# EAGLE design untitled_front (EAGLE 8.2.1)
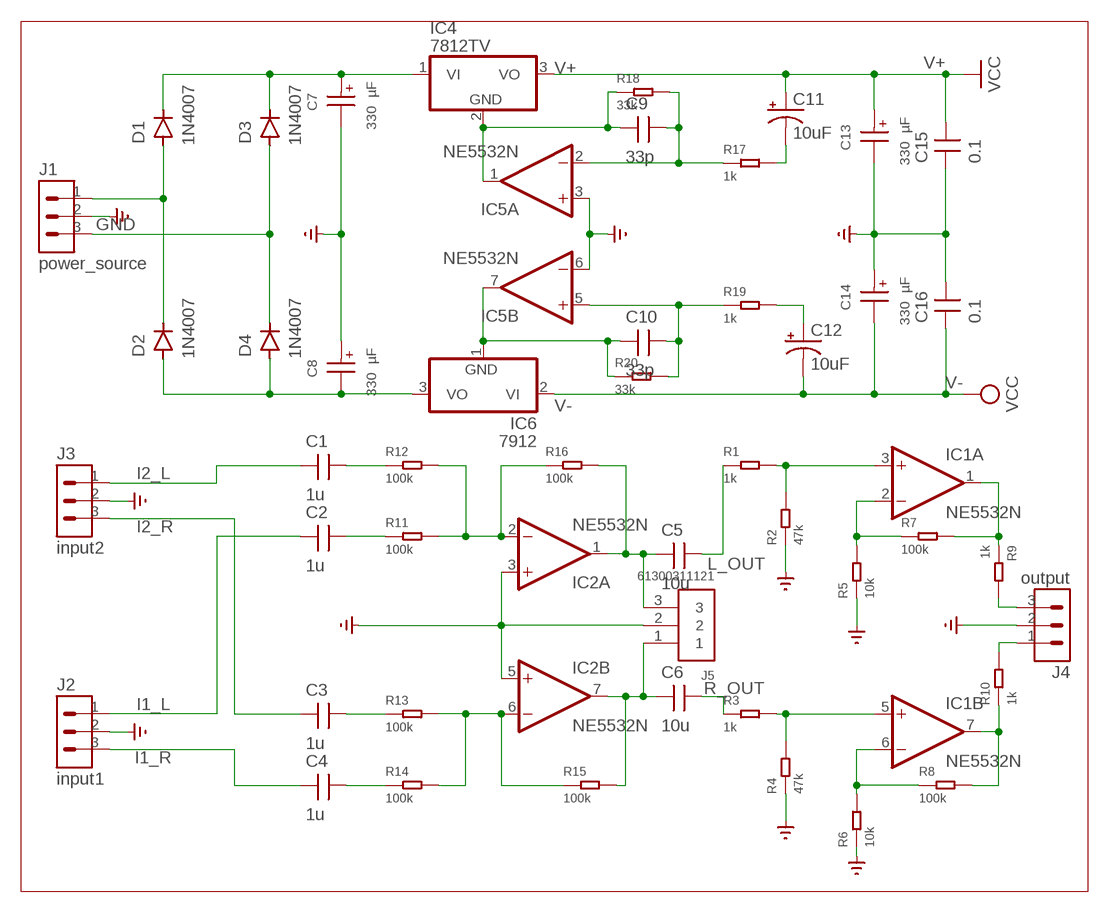
[diagram p0: schematic, sheet 1]

## Parts
C1  1u  5.08MM-  [5.08MM-独石电容]
C2  1u  5.08MM-  [5.08MM-独石电容]
C3  1u  5.08MM-  [5.08MM-独石电容]
C4  1u  5.08MM-  [5.08MM-独石电容]
C5  10u  5.08MM-  [5.08MM-独石电容]
C6  10u  5.08MM-  [5.08MM-独石电容]
C7  330 µF  WCAP-AT1H_18X35.5_860241081001  [WCAP-AT1H_18X35.5(DXL)]
C8  330 µF  WCAP-AT1H_18X35.5_860241081001  [WCAP-AT1H_18X35.5(DXL)]
C9  33p  5.08MM-  [5.08MM-独石电容]
C10  33p  5.08MM-  [5.08MM-独石电容]
C11  10uF  10UF-POLAR-RADIAL-2.5MM-25V-20%  [CPOL-RADIAL-2.5MM-5MM]
C12  10uF  10UF-POLAR-RADIAL-2.5MM-25V-20%  [CPOL-RADIAL-2.5MM-5MM]
C13  330 µF  WCAP-AT1H_18X35.5_860241081001  [WCAP-AT1H_18X35.5(DXL)]
C14  330 µF  WCAP-AT1H_18X35.5_860241081001  [WCAP-AT1H_18X35.5(DXL)]
C15  0.1  5.08MM-  [5.08MM-独石电容]
C16  0.1  5.08MM-  [5.08MM-独石电容]
D1  1N4007  [DO-41]
D2  1N4007  [DO-41]
D3  1N4007  [DO-41]
D4  1N4007  [DO-41]
IC1  NE5532N  [DIL08]
IC2  NE5532N  [DIL08]
IC4  7812TV  [TO220V]
IC5  NE5532N  [DIL08]
IC6  7912  7912T  [TO220H]
J1  power_source  B3P-VH(LF)(SN)  [HDR-03]
J2  input1  B3P-VH(LF)(SN)  [HDR-03]
J3  input2  B3P-VH(LF)(SN)  [HDR-03]
J4  output  B3P-VH(LF)(SN)  [HDR-03]
J5  61300311121  [61300311121]
R1  1k  DIP-RES-1M-5%-1/4W(PR-D2.3XL6.5MM)  [PR-D2.3XL6.5MM]
R2  47k  DIP-RES-1M-5%-1/4W(PR-D2.3XL6.5MM)  [PR-D2.3XL6.5MM]
R3  1k  DIP-RES-1M-5%-1/4W(PR-D2.3XL6.5MM)  [PR-D2.3XL6.5MM]
R4  47k  DIP-RES-1M-5%-1/4W(PR-D2.3XL6.5MM)  [PR-D2.3XL6.5MM]
R5  10k  DIP-RES-1M-5%-1/4W(PR-D2.3XL6.5MM)  [PR-D2.3XL6.5MM]
R6  10k  DIP-RES-1M-5%-1/4W(PR-D2.3XL6.5MM)  [PR-D2.3XL6.5MM]
R7  100k  DIP-RES-1M-5%-1/4W(PR-D2.3XL6.5MM)  [PR-D2.3XL6.5MM]
R8  100k  DIP-RES-1M-5%-1/4W(PR-D2.3XL6.5MM)  [PR-D2.3XL6.5MM]
R9  1k  DIP-RES-1M-5%-1/4W(PR-D2.3XL6.5MM)  [PR-D2.3XL6.5MM]
R10  1k  DIP-RES-1M-5%-1/4W(PR-D2.3XL6.5MM)  [PR-D2.3XL6.5MM]
R11  100k  DIP-RES-1M-5%-1/4W(PR-D2.3XL6.5MM)  [PR-D2.3XL6.5MM]
R12  100k  DIP-RES-1M-5%-1/4W(PR-D2.3XL6.5MM)  [PR-D2.3XL6.5MM]
R13  100k  DIP-RES-1M-5%-1/4W(PR-D2.3XL6.5MM)  [PR-D2.3XL6.5MM]
R14  100k  DIP-RES-1M-5%-1/4W(PR-D2.3XL6.5MM)  [PR-D2.3XL6.5MM]
R15  100k  DIP-RES-1M-5%-1/4W(PR-D2.3XL6.5MM)  [PR-D2.3XL6.5MM]
R16  100k  DIP-RES-1M-5%-1/4W(PR-D2.3XL6.5MM)  [PR-D2.3XL6.5MM]
R17  1k  DIP-RES-1M-5%-1/4W(PR-D2.3XL6.5MM)  [PR-D2.3XL6.5MM]
R18  33k  DIP-RES-1M-5%-1/4W(PR-D2.3XL6.5MM)  [PR-D2.3XL6.5MM]
R19  1k  DIP-RES-1M-5%-1/4W(PR-D2.3XL6.5MM)  [PR-D2.3XL6.5MM]
R20  33k  DIP-RES-1M-5%-1/4W(PR-D2.3XL6.5MM)  [PR-D2.3XL6.5MM]

## Nets
GND: C7.2(-) C8.1(+) C13.2(-) C14.1(+) C15.P$2 C16.P$1 IC2.3(A:+IN) IC2.5(B:+IN) IC5.3(A:+IN) IC5.6(B:-IN) J1.2 J2.2 J3.2 J4.2 J5.2 R2.1 R4.1 R5.1 R6.1 ; supply symbol labelled SUPPLY_BRASTAN_GND_
I1_L: C2.P$2 J2.1
I1_R: C4.P$2 J2.3
I2_L: C1.P$2 J3.1
I2_R: C3.P$2 J3.3
L_OUT: C5.P$1 R1.1
N$1: IC1.6(B:-IN) R6.2 R8.1
N$2: IC1.2(A:-IN) R5.2 R7.1
N$3: IC1.3(A:+IN) R1.2 R2.2
N$4: IC1.5(B:+IN) R3.2 R4.2
N$5: IC1.7(B:OUT) R8.2 R10.1
N$6: IC1.1(A:OUT) R7.2 R9.1
N$7: J4.1 R10.2
N$8: J4.3 R9.2
N$9: D1.A D2.C J1.1
N$10: C3.P$1 R13.1
N$11: C1.P$1 R12.1
N$12: C2.P$1 R11.1
N$13: C4.P$1 R14.1
N$14: IC2.6(B:-IN) R13.2 R14.2 R15.1
N$15: IC2.2(A:-IN) R11.2 R12.2 R16.1
N$16: C6.P$2 IC2.7(B:OUT) J5.1 R15.2
N$17: C5.P$2 IC2.1(A:OUT) J5.3 R16.2
N$18: D3.A D4.C J1.3
N$19: C8.2(-) D2.A D4.A IC6.3(VO)
N$20: C7.1(+) D1.C D3.C IC4.1(VI)
N$22: C9.P$2 IC4.2(GND) IC5.1(A:OUT) R18.1
N$23: C10.P$1 IC5.5(B:+IN) R19.1 R20.2
N$24: C9.P$1 IC5.2(A:-IN) R17.1 R18.2
N$25: C10.P$2 IC5.7(B:OUT) IC6.1(GND) R20.1
N$27: C12.1(+) R19.2
N$28: C11.2(-) R17.2
R_OUT: C6.P$1 R3.1
V+: C11.1(+) C13.1(+) C15.P$1 IC4.3(VO) ; supply symbol labelled VCC
V-: C12.2(-) C14.2(-) C16.P$2 IC6.2(VI) ; supply symbol labelled VCC

## Power pins joined to a net without a drawn wire
V+: IC1.8(P:V+) IC2.8(P:V+) IC5.8(P:V+)
V-: IC1.4(P:V-) IC2.4(P:V-) IC5.4(P:V-)

## Library data of the parts
C1-C6 C9 C10 C15 C16 = Audio-Power-amlifier:5.08MM-; LONG: 5.08mm
C7 C8 C13 C14 = Wurth_Capacitors_WCAP-AT1H:WCAP-AT1H_18X35.5: WCAP-AT1H Aluminium Electrolytic Capacitors Long Life +105 °C Characteristics Long life product series Mounting style: THT Radial Capacitance range: 6.8 µF ‒ 3300 µF Capacitance tolerance: ±20 % Voltage range (UR): 10 ‒ 450 V(DC) Operating temperature: -40 °C up to +105 °C for UR ≤100 V(DC) -25 °C up to +105 °C for UR > 100 V(DC) Endurance: 5000 ‒ 10000 h @ +105 °C Dimensions (DxL) in mm: 5.0 x 11.0 up to 18.0 x 35.5 Recommended soldering: Wave soldering Applications Long life applications (industry, medical) Filtering Smoothing Energy storage Coupling e.g. Switched-mode power supply, AC/DC converter, adapter, charger, digital camera <https://www.we-online.com/catalog/media/o14727v209%20Family_WCAP-AT1H.jpg> Details see: https://www.we-online.com/catalog/en/WCAP-AT1H/ Updated by yingchun,Shan;2020-02-28 2020(C) Würth Elektronik; DATASHEET-URL: https://www.we-online.com/catalog/datasheet/860241081001.pdf; DF: 15%; DIAMETER: 18mm; I-LEAK: 2740uA; I-RIPPLE: 3220mA; L: 35.5mm; OPERATING-TEMPERATURE: -25 °C up to +105 °C; PART-NUMBER: 860241081001; PITCH: 7.5mm; TECHNICAL-REFERENCE: ATJL355331M200DSPAEK000; VR: 200V(DC)
C11 C12 = SparkFun-Capacitors:10UF-POLAR: 10.0µF polarized capacitors A capacitor is a passive two-terminal electrical component used to store electrical energy temporarily in an electric field.; PROD_ID: CAP-08440
D1-D4 = Diodes:1N4007: DIODE GEN PURP 1KV 1A DO41 Manufacturer's datasheet <https://www.mccsemi.com/pdf/Products/1N4001-1N4007(DO-41).pdf>; CREATED_BY: PCBLayout.com; DIGIKEY_PART_NUMBER: 1N4007MSCT-ND; MANUFACTURER: Micro Commercial Co; MPN: 1N4007; PACKAGE: DO-41
IC1 IC2 IC5 = linear:NE5532: AUDIO AMPLIFIER
IC4 = linear:78*: Positive VOLTAGE REGULATOR Source: http://cache.national.com/ds/LM/LM78L05.pdf http://www.fairchildsemi.com/ds/LM/LM7805.pdf
IC6 = linear:79*: Negative VOLTAGE REGULATOR
J1-J4 = Connectors:B3P-VH(LF)(SN): CONN HEADER VERT 3POS 3.96MM Manufacturer's datasheet <http://www.jst-mfg.com/product/pdf/eng/eVH.pdf>; CREATED_BY: PCBLayout.com; DIGIKEY_PART_NUMBER: 455-1640-ND; MANUFACTURER: JST Sales America Inc.; MPN: B3P-VH(LF)(SN)
J5 = Headers:61300311121: CONN HEADER VERT 3POS 2.54MM Manufacturer's datasheet <https://katalog.we-online.de/em/datasheet/6130xx11121.pdf>; CREATED_BY: PCBLayout.com; DIGI_KEY_PART_NUMBER: 732-5316-ND; MANUFACTURER: Wurth Electronics Inc.; MPN: 61300311121
R1-R20 = OPL_Resistor:DIP-RES-1M-5%-1/4W(PR-D2.3XL6.5MM): 301020005; MPN: FHCFR-1/4W-105J; VALUE: 1M

## Board
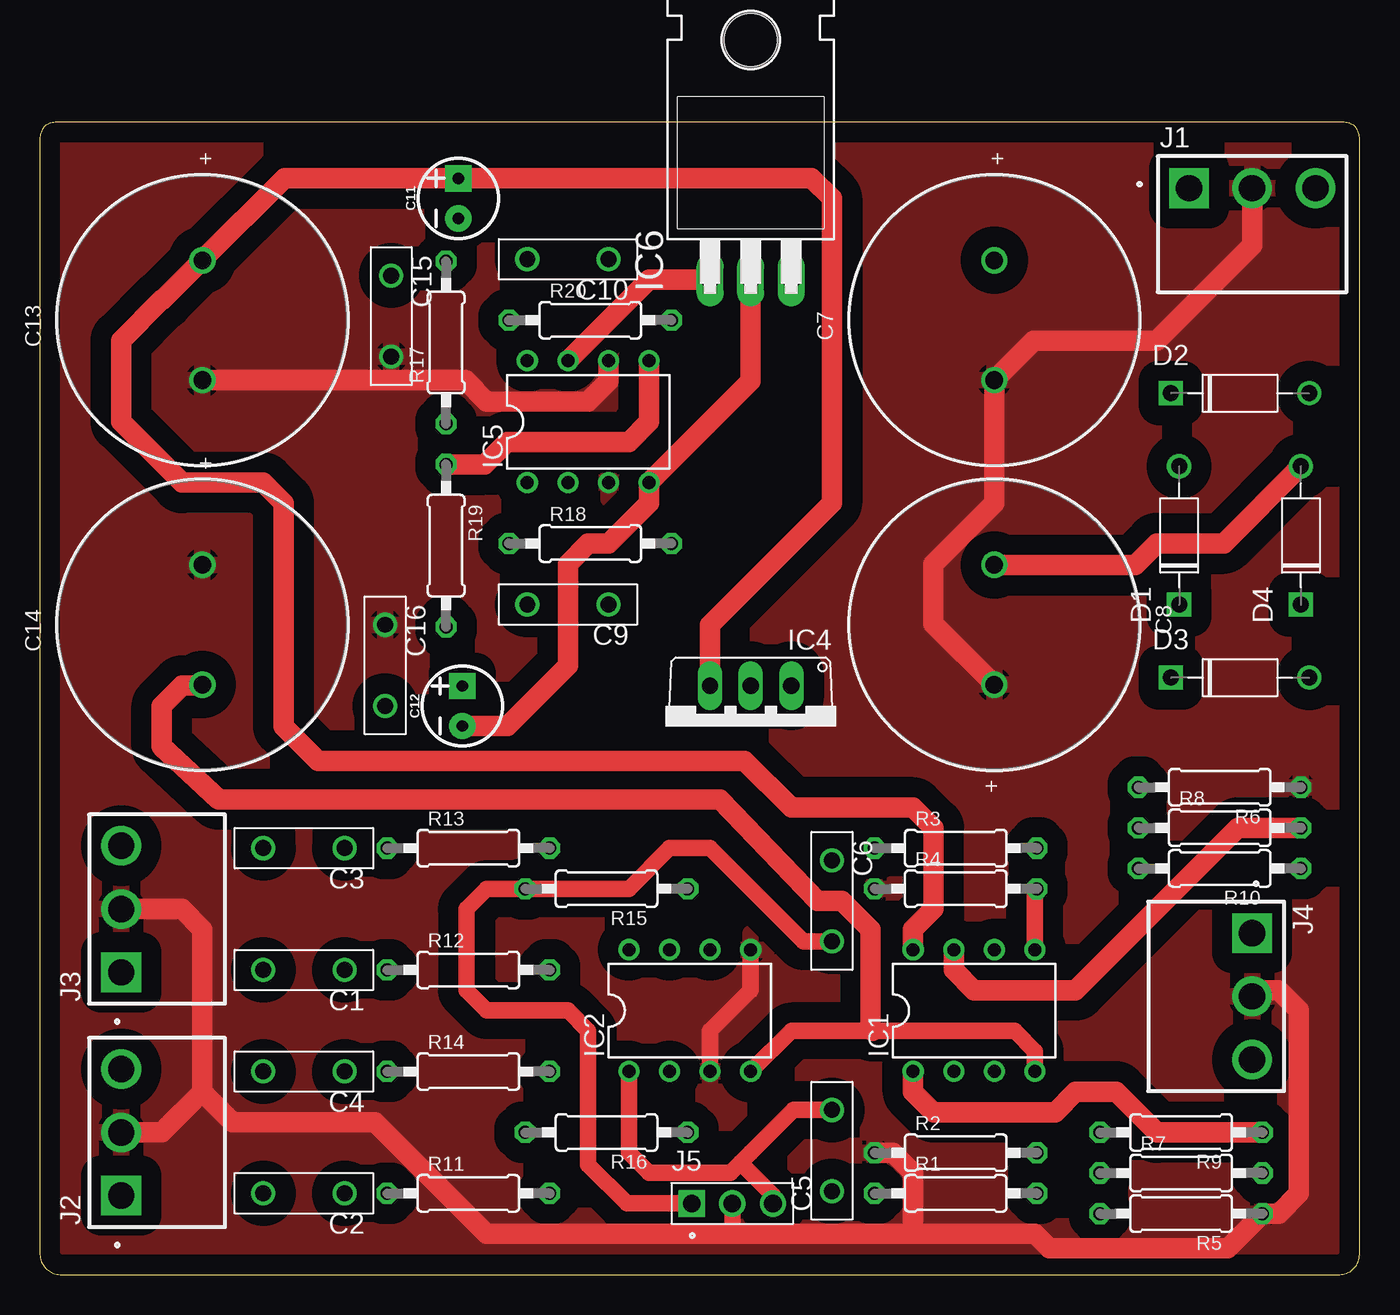
[diagram p1: board, top side]
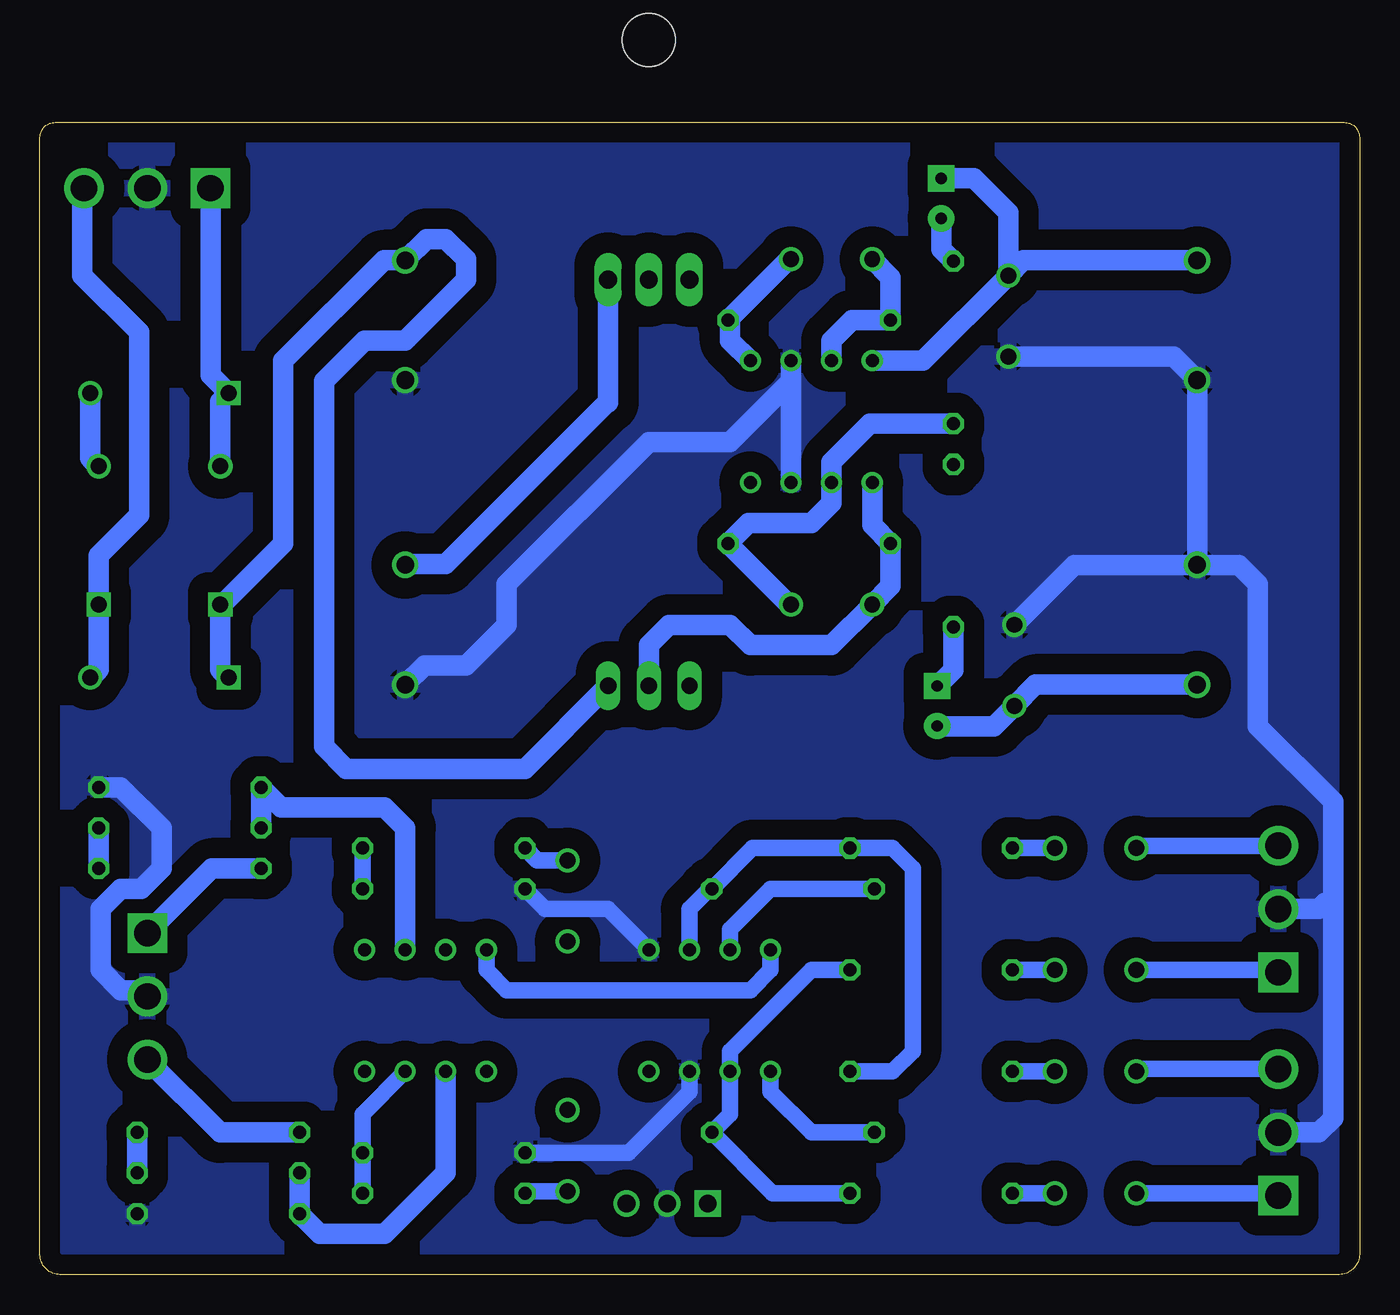
[diagram p2: board, bottom side, seen from below]

Size 82.53 x 72.06 mm. Coordinates in mm from the lower left corner, seen from the top.
Outline: 0,71.12 0,1.27 arc90 1.27,0 81.28,0 arc90 82.53,1.25 82.53,71.12 arc90 81.59,72.06 0.94,72.06 arc90 0,71.12
Copper layers (1*16): Top 0.035mm / dielectric 1.5mm / Bottom 0.035mm
Design rules "default": minimum track width 6mil, minimum drill 0.35mm, track to track 6mil, track to pad 6mil, pad to pad 6mil, via to via 6mil, smd to smd 6mil, copper to edge 40mil, drill to drill 6mil, minimum pad ring 10mil, minimum via ring 8mil, stop-mask expansion 4mil, vias tented up to drill 0mil, thermal gap 10mil

### Footprints (pad centres in the part's own frame; a part is rotated, then mirrored left to right if it is on the bottom)
5.08MM-独石电容 = drill 1: P$1 -2.54,0; P$2 2.54,0
WCAP-AT1H_18X35.5(DXL) = drill 1.1: 1 3.75,0; 2 -3.75,0
CPOL-RADIAL-2.5MM-5MM = drill 0.7 pad 1.651 square: 1 1.25,0 | drill 0.7 pad 1.651: 2 -1.25,0
DO-41 = drill 1: A 4.325,0 | drill 1 square: C -4.325,0
DIL08 = drill 0.813 pad 1.27: 1 -3.81,-3.81; 2 -1.27,-3.81; 3 1.27,-3.81; 4 3.81,-3.81; 5 3.81,3.81; 6 1.27,3.81; 7 -1.27,3.81; 8 -3.81,3.81
TO220V = drill 1.016 long: 1 -2.54,-2.54; 2 0,-2.54; 3 2.54,-2.54
TO220H = drill 1.118 long: 1 -2.54,-10.16; 2 0,-10.16; 3 2.54,-10.16 | hole 3.302: 0,4.826
HDR-03 = drill 1.65 square: 1 -3.96,0 | drill 1.65: 2 0,0; 3 3.96,0
61300311121 = drill 1.1 square: 1 -2.54,0 | drill 1.1: 2 0,0; 3 2.54,0
PR-D2.3XL6.5MM = drill 0.813 octagon: 1 -4.953,0; 2 5.207,0

### Placement (x,y rotation side)
C1  16.51,19.05 180 top
C2  16.51,5.08 180 top
C3  16.51,26.67 180 top
C4  16.51,12.7 180 top
C5  49.53,7.75 90 top
C6  49.53,23.37 270 top
C7  59.69,59.69 90 top
C8  59.69,40.64 270 top
C9  33.02,41.91 180 top
C10  33.02,63.5 180 top
C11  26.16,67.31 90 top
C12  26.42,35.56 90 top
C13  10.16,59.69 90 top
C14  10.16,40.64 90 top
C15  21.97,59.94 270 top
C16  21.59,38.1 270 top
D1  71.25,46.23 90 top
D2  75.06,55.12 0 top
D3  75.06,37.34 0 top
D4  78.87,46.23 90 top
IC1  58.42,16.51 0 top
IC2  40.64,16.51 0 top
IC4  44.45,34.29 180 top
IC5  34.29,53.34 0 top
IC6  44.45,72.39 0 top
J1  75.82,67.94 0 top
J2  5.08,8.89 90 top
J3  5.08,22.86 90 top
J4  75.82,17.4 270 top
J5  43.31,4.45 0 top
R1  57.15,5.08 0 top
R2  57.15,7.62 0 top
R3  57.15,26.67 0 top
R4  57.15,24.13 0 top
R5  71.5,3.81 180 top
R6  73.91,30.48 180 top
R7  71.25,6.35 0 top
R8  73.66,27.94 0 top
R9  71.5,8.89 180 top
R10  73.91,25.4 180 top
R11  26.67,5.08 0 top
R12  26.67,19.05 0 top
R13  26.67,26.67 0 top
R14  26.67,12.7 0 top
R15  35.56,24.13 180 top
R16  35.56,8.89 180 top
R17  25.4,58.17 90 top
R18  34.29,45.72 0 top
R19  25.4,45.72 270 top
R20  34.29,59.69 0 top

### Tracks (layer width: path | path; a pad name or v marks a point on that pad's centre or on a via)
GND
  Top 1.016: IC2.5 44.45,17.78 41.91,15.24 IC2.3 | J5.2 43.31,2.67 43.18,2.54
  Top 1.27: C13.2 26.61,55.94 27.94,54.61 34.29,54.61 35.56,55.88 IC5.6 | J2.2 7.62,8.89 10.16,11.43 | 10.16,11.43 10.16,21.59 8.89,22.86 J3.2 | 10.16,11.43 12.06,9.53 20.95,9.53 27.94,2.54 43.18,2.54 54.61,2.54 | C8.1 55.88,40.7 55.88,44.45 59.69,48.26 C7.2 62.17,58.42 69.85,58.42 75.82,64.39 J1.2 | 54.61,2.54 62.23,2.54 63.12,1.65 74.3,1.65 R5.1 77.47,3.81 78.74,5.08 78.74,16.51 77.47,17.78 76.2,17.78 J4.2 | R2.1 53.34,7.62 54.61,6.35 54.61,2.54
  Bottom 1.016: IC2.5 46.99,22.86 50.93,22.86 R4.1 | IC2.3 41.91,11.43 45.72,7.62 R2.1
  Bottom 1.27: C15.P$2 11.62,57.4 C13.2 C14.1 | C14.1 17.84,44.39 C16.P$1 | IC5.3 IC5.6 35.56,55.88 39.37,52.07 44.45,52.07 53.34,43.18 53.34,40.64 55.88,38.1 58.48,38.1 C8.1 | C14.1 7.56,44.39 6.35,43.18 6.35,34.29 1.65,29.59 1.65,23.24 | 1.65,23.24 2.16,23.24 2.54,22.86 J3.2 | 1.65,23.24 1.65,9.78 2.54,8.89 J2.2 | R6.1 77.47,30.48 74.93,27.94 74.93,25.4 76.2,24.13 77.47,24.13 78.74,22.86 78.74,19.05 77.47,17.78 76.2,17.78 J4.2
  pour Top (isolate 1.27): 1.27,72.39 0,71.12 0,1.27 1.27,0 81.28,0 82.55,1.27 82.55,71.12 81.28,72.39
  pour Bottom (isolate 1.27): 1.27,72.39 0,71.12 0,1.27 1.27,0 81.28,0 82.55,1.27 82.55,71.12 81.28,72.39
I1_L
  Bottom 1.016: C2.P$2 5.23,5.08 J2.1
I1_R
  Bottom 1.016: J2.3 13.82,12.85 C4.P$2
I2_L
  Bottom 1.016: C1.P$2 5.23,19.05 J3.1
I2_R
  Bottom 1.016: J3.3 13.82,26.82 C3.P$2
L_OUT
  Bottom 1.016: C5.P$1 52.07,5.21 R1.1
N$1
  Bottom 1.27: R8.1 R6.2 67.44,29.21 60.96,29.21 59.69,27.94 IC1.6
N$2
  Bottom 1.27: R7.1 R5.2 65.02,2.54 60.96,2.54 57.15,6.35 IC1.2
N$3
  Bottom 1.016: R1.2 R2.2 62.36,10.03 IC1.3
N$4
  Top 1.016: IC1.5 62.23,24 R4.2
  Bottom 1.016: R4.2 R3.2
N$5
  Top 1.27: IC1.7 57.15,19.05 58.42,17.78 64.77,17.78 74.93,27.94 R8.2
  Bottom 1.27: R8.2 R10.1
N$6
  Top 1.27: R9.1 69.85,8.89 67.31,11.43 64.77,11.43 63.5,10.16 55.88,10.16 54.61,11.43 IC1.1
  Bottom 1.27: R9.1 R7.2
N$7
  Bottom 1.27: R10.2 71.78,25.4 J4.1
N$8
  Bottom 1.27: R9.2 71.27,8.89 J4.3
N$9
  Bottom 1.27: D2.C 71.1,55.48 | D1.A 71.25,54.6 D2.C | J1.1 71.86,56.24 D2.C
N$10
  Bottom 1.016: C3.P$1 R13.1
N$11
  Bottom 1.016: C1.P$1 R12.1
N$12
  Bottom 1.016: R11.1 C2.P$1
N$13
  Bottom 1.016: C4.P$1 R14.1
N$14
  Bottom 1.016: IC2.6 41.91,22.86 40.64,24.13 R15.1 37.97,26.67 R13.2 29.21,26.67 27.94,25.4 27.94,13.97 29.21,12.7 R14.2
N$15
  Bottom 1.016: R12.2 34.29,19.05 39.37,13.97 IC2.2 39.37,10.03 R16.1 36.7,5.08 R11.2
N$16
  Top 1.016: C6.P$2 47.75,20.83 41.91,26.67 39.37,26.67 36.83,24.13 R15.2 27.94,24.13 26.67,22.86 26.67,17.78 27.94,16.51 33.02,16.51 34.29,15.24 34.29,6.86 36.7,4.45 J5.1
  Bottom 1.016: R15.2 36.83,24.13 39.37,21.59 IC2.7
N$17
  Top 1.016: C5.P$2 47.12,10.29 44.45,7.62 43.81,6.99 | 43.81,6.99 43.18,6.35 38.1,6.35 36.83,7.62 IC2.1 | J5.3 45.85,4.95 43.81,6.99
  Bottom 1.016: R16.2 34.29,8.89 36.83,11.43 IC2.1
N$18
  Bottom 1.27: D3.A 78.87,37.85 D4.C 78.87,44.96 76.33,47.5 76.33,58.93 79.88,62.48 79.88,67.84 J1.3
N$19
  Top 1.27: D4.A 74.03,45.72 69.85,45.72 68.52,44.39 C8.2
  Bottom 1.27: D2.A 79.38,51.07 D4.A | IC6.3 46.99,54.55 47.05,54.55 57.15,44.45 59.63,44.45 C8.2
N$20
  Bottom 1.27: D3.C 71.25,37.85 D1.C 71.12,41.91 67.31,45.72 67.31,57.15 61.02,63.44 C7.1 58.36,64.77 57.15,64.77 55.88,63.5 55.88,62.23 59.69,58.42 62.23,58.42 64.77,55.88 64.77,33.02 63.37,31.62 52.2,31.62 IC4.1
N$22
  Bottom 1.27: IC5.1 30.48,46.86 R18.1 29.34,43.05 C9.P$2 33.02,39.37 38.1,39.37 39.37,40.64 43.18,40.64 44.45,39.37 IC4.2
N$23
  Top 1.27: R19.1 27.81,50.67 29.21,52.07 36.83,52.07 38.1,53.34 IC5.5
  Bottom 1.27: IC5.5 39.37,58.42 39.37,59.56 R20.2 35.69,63.5 C10.P$1
N$24
  Bottom 1.27: C9.P$1 35.69,41.91 R18.2 38.23,46.99 34.29,46.99 33.02,48.26 IC5.2 33.02,50.8 30.61,53.21 R17.1
N$25
  Top 1.27: IC6.1 38.1,62.23 IC5.7
  Bottom 1.27: C10.P$2 29.34,62.36 R20.1 31.75,59.69 33.02,58.42 IC5.7
N$27
  Bottom 1.27: R19.2 25.4,37.83 C12.1
N$28
  Bottom 1.27: C11.2 26.16,64.14 R17.2
R_OUT
  Bottom 1.016: C6.P$1 51.44,25.91 R3.1
V+
  Top 1.27: IC4.3 41.91,40.64 49.53,48.26 49.53,67.31 48.26,68.58 15.3,68.58 C13.1 7.68,60.96 7.62,60.96 5.08,58.42 5.08,53.34 8.89,49.53 13.97,49.53 15.24,48.26 15.24,34.29 17.4,32.13 44.07,32.13 46.99,29.21 54.61,29.21 55.88,27.94 55.88,22.86 54.61,21.59 IC1.8
  Bottom 1.016: IC2.8 36.83,19.05 38.1,17.78 53.34,17.78 54.61,19.05 IC1.8
  Bottom 1.27: C13.1 21.02,63.44 C15.P$1 | C15.P$1 21.97,66.42 24.13,68.58 26.14,68.58 C11.1 | IC5.8 27.3,57.15 C15.P$1
V-
  Top 1.016: IC2.4 46.99,15.24 52.07,15.24 60.96,15.24 62.23,13.97 IC1.4
  Top 1.27: C12.2 29.23,34.31 33.02,38.1 33.02,44.45 34.29,45.72 35.56,45.72 38.1,48.26 IC5.4 44.45,55.88 IC6.2 | 52.07,15.24 51.94,15.37 51.94,21.59 50.16,23.37 48.64,23.37 42.55,29.72 11.18,29.72 7.62,33.02 7.62,35.56 8.89,36.83 10.1,36.83 C14.2
  Bottom 1.27: C14.2 20.26,36.89 C16.P$2 22.86,34.29 26.4,34.29 C12.2